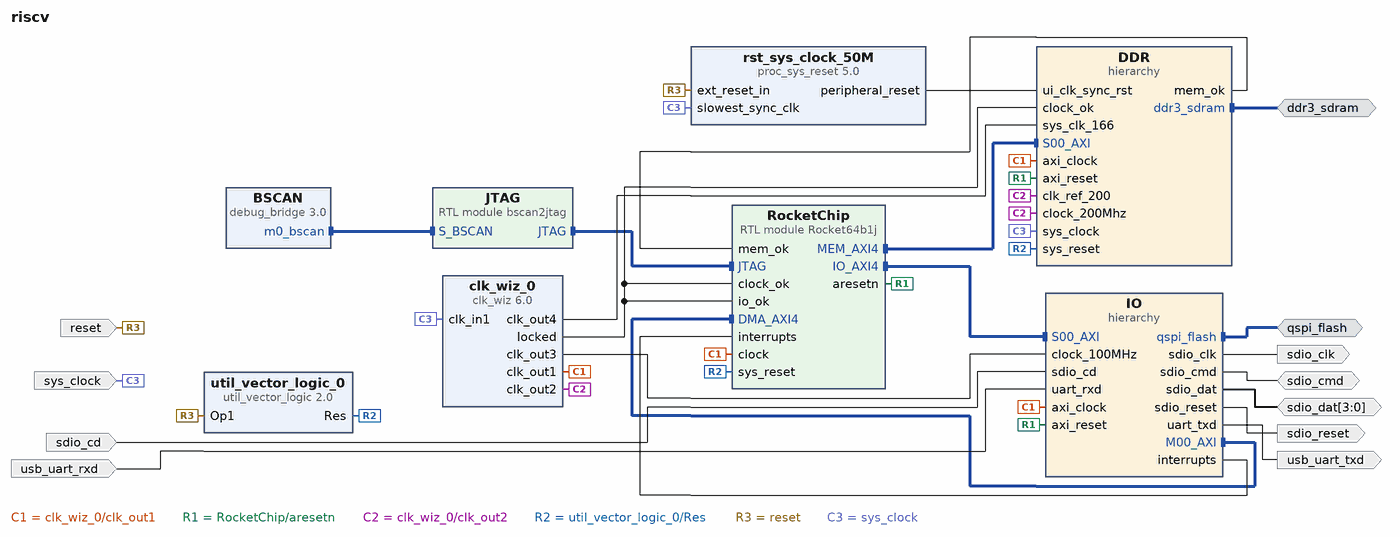
[diagram p0: block diagram of the top level]
# Vivado block design riscv, xc7k325tffg676-1, Vivado 2022.1
create_bd_design riscv

create_bd_intf_port -mode Master -vlnv xilinx.com:interface:ddrx_rtl:1.0 ddr3_sdram
create_bd_intf_port -mode Master -vlnv xilinx.com:interface:spi_rtl:1.0 qspi_flash
create_bd_port -dir I -type rst reset
set_property -dict {CONFIG.POLARITY ACTIVE_LOW} [get_bd_ports reset]
create_bd_port -dir I sdio_cd
create_bd_port -dir O sdio_clk
create_bd_port -dir IO sdio_cmd
create_bd_port -dir IO -from 3 -to 0 sdio_dat
create_bd_port -dir O -type rst sdio_reset
create_bd_port -dir I -type clk sys_clock
set_property -dict {CONFIG.FREQ_HZ 50000000 CONFIG.PHASE 0.0} [get_bd_ports sys_clock]
create_bd_port -dir I usb_uart_rxd
create_bd_port -dir O usb_uart_txd

create_bd_cell -type hier DDR
create_bd_cell -type hier IO
create_bd_cell -type ip -vlnv xilinx.com:ip:debug_bridge:3.0 BSCAN
set_property -dict {CONFIG.C_DEBUG_MODE 7 CONFIG.C_NUM_BS_MASTER 1 CONFIG.C_USER_SCAN_CHAIN 1} [get_bd_cells BSCAN]
create_bd_cell -type module -reference bscan2jtag JTAG
create_bd_cell -type module -reference Rocket64b1j RocketChip
create_bd_cell -type ip -vlnv xilinx.com:ip:clk_wiz:6.0 clk_wiz_0
set_property -dict [list \
  CONFIG.CLKIN1_JITTER_PS 200.0 \
  CONFIG.CLKOUT1_JITTER 170.644 \
  CONFIG.CLKOUT1_PHASE_ERROR 164.985 \
  CONFIG.CLKOUT1_REQUESTED_OUT_FREQ 80.0 \
  CONFIG.CLKOUT1_USED true \
  CONFIG.CLKOUT2_JITTER 142.107 \
  CONFIG.CLKOUT2_PHASE_ERROR 164.985 \
  CONFIG.CLKOUT2_REQUESTED_OUT_FREQ 200 \
  CONFIG.CLKOUT2_USED true \
  CONFIG.CLKOUT3_JITTER 162.035 \
  CONFIG.CLKOUT3_PHASE_ERROR 164.985 \
  CONFIG.CLKOUT3_REQUESTED_OUT_FREQ 100 \
  CONFIG.CLKOUT3_USED true \
  CONFIG.CLKOUT4_JITTER 146.458 \
  CONFIG.CLKOUT4_PHASE_ERROR 164.985 \
  CONFIG.CLKOUT4_REQUESTED_OUT_FREQ 166.66667 \
  CONFIG.CLKOUT4_USED true \
  CONFIG.CLKOUT5_JITTER 125.247 \
  CONFIG.CLKOUT5_PHASE_ERROR 98.575 \
  CONFIG.CLKOUT5_REQUESTED_OUT_FREQ 100.000 \
  CONFIG.CLKOUT5_REQUESTED_PHASE 0.000 \
  CONFIG.CLKOUT5_USED false \
  CONFIG.CLK_IN1_BOARD_INTERFACE sys_clock \
  CONFIG.MMCM_CLKFBOUT_MULT_F 20.000 \
  CONFIG.MMCM_CLKIN1_PERIOD 20.000 \
  CONFIG.MMCM_CLKIN2_PERIOD 10.0 \
  CONFIG.MMCM_CLKOUT0_DIVIDE_F 12.500 \
  CONFIG.MMCM_CLKOUT1_DIVIDE 5 \
  CONFIG.MMCM_CLKOUT2_DIVIDE 10 \
  CONFIG.MMCM_CLKOUT3_DIVIDE 6 \
  CONFIG.MMCM_CLKOUT4_DIVIDE 1 \
  CONFIG.MMCM_CLKOUT4_PHASE 0.000 \
  CONFIG.MMCM_DIVCLK_DIVIDE 1 \
  CONFIG.NUM_OUT_CLKS 4 \
  CONFIG.PRIM_SOURCE Single_ended_clock_capable_pin \
  CONFIG.USE_BOARD_FLOW true \
  CONFIG.USE_PHASE_ALIGNMENT true \
  CONFIG.USE_RESET false \
] [get_bd_cells clk_wiz_0]
create_bd_cell -type ip -vlnv xilinx.com:ip:util_vector_logic:2.0 util_vector_logic_0
set_property -dict {CONFIG.C_OPERATION not CONFIG.C_SIZE 1} [get_bd_cells util_vector_logic_0]
create_bd_cell -type ip -vlnv xilinx.com:ip:proc_sys_reset:5.0 rst_sys_clock_50M

# ---- hierarchy /DDR ----
current_bd_instance /DDR
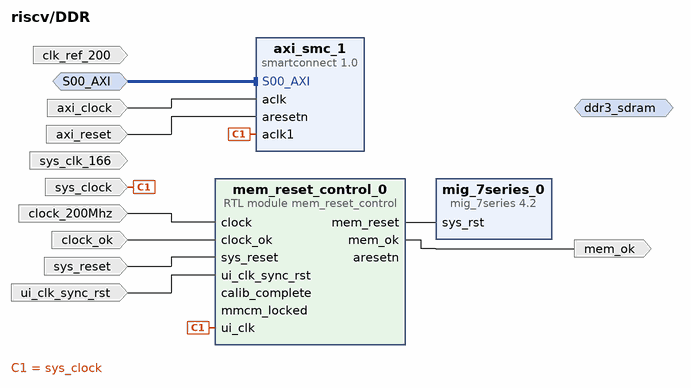
[diagram p1: block diagram inside /DDR]
create_bd_intf_pin -mode Slave -vlnv xilinx.com:interface:aximm_rtl:1.0 S00_AXI
create_bd_intf_pin -mode Master -vlnv xilinx.com:interface:ddrx_rtl:1.0 ddr3_sdram
create_bd_pin -dir I -type clk axi_clock
create_bd_pin -dir I -type rst axi_reset
create_bd_pin -dir I -type clk clk_ref_200
create_bd_pin -dir I -type clk clock_200Mhz
create_bd_pin -dir I -type clk clock_ok
create_bd_pin -dir O mem_ok
create_bd_pin -dir I -type clk sys_clk_166
create_bd_pin -dir I -type rst sys_reset
create_bd_pin -dir I -type clk sys_clock
create_bd_pin -dir I -type rst ui_clk_sync_rst

create_bd_cell -type ip -vlnv xilinx.com:ip:smartconnect:1.0 axi_smc_1
set_property -dict {CONFIG.NUM_CLKS 2 CONFIG.NUM_SI 1} [get_bd_cells axi_smc_1]
create_bd_cell -type module -reference mem_reset_control mem_reset_control_0
create_bd_cell -type ip -vlnv xilinx.com:ip:mig_7series:4.2 mig_7series_0
set_property -dict {CONFIG.BOARD_MIG_PARAM Custom} [get_bd_cells mig_7series_0]

# ---- hierarchy /IO ----
current_bd_instance /IO
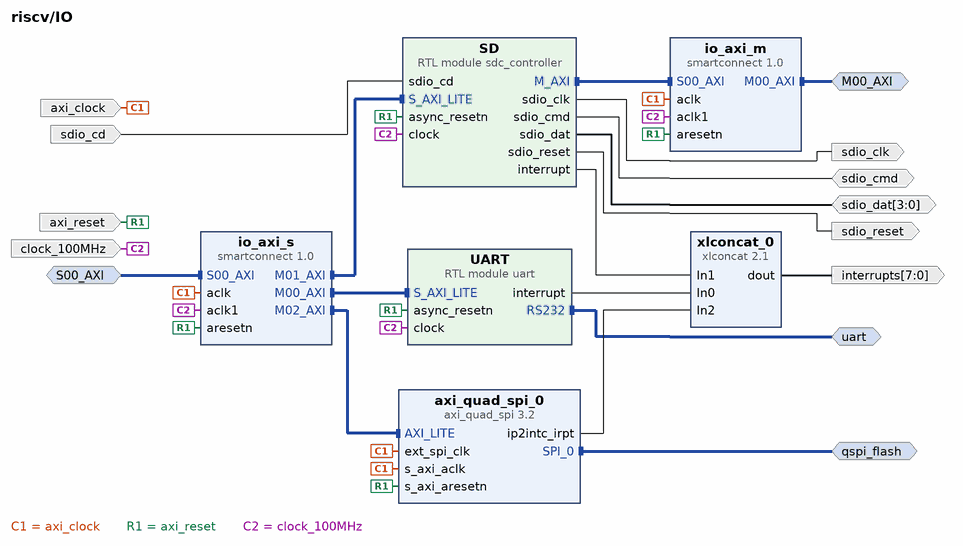
[diagram p2: block diagram inside /IO]
create_bd_intf_pin -mode Master -vlnv xilinx.com:interface:aximm_rtl:1.0 M00_AXI
create_bd_intf_pin -mode Slave -vlnv xilinx.com:interface:aximm_rtl:1.0 S00_AXI
create_bd_intf_pin -mode Master -vlnv xilinx.com:interface:spi_rtl:1.0 qspi_flash
create_bd_intf_pin -mode Master -vlnv xilinx.com:interface:uart_rtl:1.0 uart
create_bd_pin -dir I -type clk axi_clock
create_bd_pin -dir I -type rst axi_reset
create_bd_pin -dir I -type clk clock_100MHz
create_bd_pin -dir O -from 7 -to 0 interrupts
create_bd_pin -dir I sdio_cd
create_bd_pin -dir O sdio_clk
create_bd_pin -dir IO sdio_cmd
create_bd_pin -dir IO -from 3 -to 0 sdio_dat
create_bd_pin -dir O sdio_reset

create_bd_cell -type module -reference sdc_controller SD
set_property -dict {CONFIG.sdio_card_detect_level 0} [get_bd_cells SD]
create_bd_cell -type module -reference uart UART
create_bd_cell -type ip -vlnv xilinx.com:ip:axi_quad_spi:3.2 axi_quad_spi_0
set_property -dict [list \
  CONFIG.C_FAMILY artix7 \
  CONFIG.C_SPI_MEMORY 2 \
  CONFIG.C_SPI_MODE 2 \
  CONFIG.C_SUB_FAMILY artix7 \
  CONFIG.C_S_AXI4_ID_WIDTH 0 \
  CONFIG.C_USE_STARTUP 0 \
  CONFIG.QSPI_BOARD_INTERFACE Custom \
  CONFIG.USE_BOARD_FLOW true \
] [get_bd_cells axi_quad_spi_0]
create_bd_cell -type ip -vlnv xilinx.com:ip:smartconnect:1.0 io_axi_m
set_property -dict {CONFIG.NUM_CLKS 2 CONFIG.NUM_MI 1 CONFIG.NUM_SI 2} [get_bd_cells io_axi_m]
create_bd_cell -type ip -vlnv xilinx.com:ip:smartconnect:1.0 io_axi_s
set_property -dict {CONFIG.NUM_CLKS 2 CONFIG.NUM_MI 3 CONFIG.NUM_SI 1} [get_bd_cells io_axi_s]
create_bd_cell -type ip -vlnv xilinx.com:ip:xlconcat:2.1 xlconcat_0
set_property -dict {CONFIG.NUM_PORTS 8 CONFIG.dout_width 8} [get_bd_cells xlconcat_0]

# ---- connections ----

current_bd_instance /DDR
connect_bd_intf_net -intf_net MEM_AXI4 [get_bd_intf_pins S00_AXI] [get_bd_intf_pins axi_smc_1/S00_AXI]
connect_bd_net [get_bd_pins axi_clock] [get_bd_pins axi_smc_1/aclk]
connect_bd_net [get_bd_pins axi_reset] [get_bd_pins axi_smc_1/aresetn]
# net clk_ref_i_1 has one end: clk_ref_200
connect_bd_net -net clock_0_1 [get_bd_pins clock_200Mhz] [get_bd_pins mem_reset_control_0/clock]
connect_bd_net -net clock_ok_0_1 [get_bd_pins clock_ok] [get_bd_pins mem_reset_control_0/clock_ok]
# net mem_reset_control_0_aresetn has one end: mem_reset_control_0/aresetn
connect_bd_net [get_bd_pins mem_reset_control_0/mem_ok] [get_bd_pins mem_ok]
connect_bd_net [get_bd_pins mem_reset_control_0/mem_reset] [get_bd_pins mig_7series_0/sys_rst]
# net mig_7series_0_init_calib_complete has one end: mem_reset_control_0/calib_complete
# net mig_7series_0_mmcm_locked has one end: mem_reset_control_0/mmcm_locked
connect_bd_net -net mig_7series_0_ui_clk [get_bd_pins sys_clock] [get_bd_pins axi_smc_1/aclk1] [get_bd_pins mem_reset_control_0/ui_clk]
# net sys_clk_i_1 has one end: sys_clk_166
connect_bd_net -net sys_reset_0_1 [get_bd_pins sys_reset] [get_bd_pins mem_reset_control_0/sys_reset]
connect_bd_net [get_bd_pins ui_clk_sync_rst] [get_bd_pins mem_reset_control_0/ui_clk_sync_rst]

current_bd_instance /IO
connect_bd_intf_net [get_bd_intf_pins qspi_flash] [get_bd_intf_pins axi_quad_spi_0/SPI_0]
connect_bd_intf_net [get_bd_intf_pins uart] [get_bd_intf_pins UART/RS232]
connect_bd_intf_net [get_bd_intf_pins M00_AXI] [get_bd_intf_pins io_axi_m/M00_AXI]
connect_bd_intf_net [get_bd_intf_pins S00_AXI] [get_bd_intf_pins io_axi_s/S00_AXI]
connect_bd_intf_net [get_bd_intf_pins UART/S_AXI_LITE] [get_bd_intf_pins io_axi_s/M00_AXI]
connect_bd_intf_net [get_bd_intf_pins SD/S_AXI_LITE] [get_bd_intf_pins io_axi_s/M01_AXI]
connect_bd_intf_net [get_bd_intf_pins axi_quad_spi_0/AXI_LITE] [get_bd_intf_pins io_axi_s/M02_AXI]
connect_bd_intf_net -intf_net sd_axi_m [get_bd_intf_pins SD/M_AXI] [get_bd_intf_pins io_axi_m/S00_AXI]
connect_bd_net [get_bd_pins axi_clock] \
  [get_bd_pins axi_quad_spi_0/ext_spi_clk] [get_bd_pins axi_quad_spi_0/s_axi_aclk] [get_bd_pins io_axi_m/aclk] \
  [get_bd_pins io_axi_s/aclk]
connect_bd_net [get_bd_pins axi_reset] \
  [get_bd_pins SD/async_resetn] [get_bd_pins UART/async_resetn] [get_bd_pins axi_quad_spi_0/s_axi_aresetn] \
  [get_bd_pins io_axi_m/aresetn] [get_bd_pins io_axi_s/aresetn]
connect_bd_net [get_bd_pins SD/interrupt] [get_bd_pins xlconcat_0/In1]
connect_bd_net -net SD_sdio_cd [get_bd_pins sdio_cd] [get_bd_pins SD/sdio_cd]
connect_bd_net [get_bd_pins SD/sdio_clk] [get_bd_pins sdio_clk]
connect_bd_net -net SD_sdio_cmd [get_bd_pins sdio_cmd] [get_bd_pins SD/sdio_cmd]
connect_bd_net -net SD_sdio_dat [get_bd_pins sdio_dat] [get_bd_pins SD/sdio_dat]
connect_bd_net [get_bd_pins SD/sdio_reset] [get_bd_pins sdio_reset]
connect_bd_net [get_bd_pins UART/interrupt] [get_bd_pins xlconcat_0/In0]
connect_bd_net [get_bd_pins axi_quad_spi_0/ip2intc_irpt] [get_bd_pins xlconcat_0/In2]
connect_bd_net [get_bd_pins clock_100MHz] [get_bd_pins SD/clock] [get_bd_pins UART/clock] [get_bd_pins io_axi_m/aclk1] [get_bd_pins io_axi_s/aclk1]
connect_bd_net -net interrupts [get_bd_pins xlconcat_0/dout] [get_bd_pins interrupts]

current_bd_instance /
connect_bd_intf_net [get_bd_intf_pins BSCAN/m0_bscan] [get_bd_intf_pins JTAG/S_BSCAN]
connect_bd_intf_net [get_bd_intf_ports ddr3_sdram] [get_bd_intf_pins DDR/ddr3_sdram]
connect_bd_intf_net [get_bd_intf_ports qspi_flash] [get_bd_intf_pins IO/qspi_flash]
connect_bd_intf_net [get_bd_intf_pins JTAG/JTAG] [get_bd_intf_pins RocketChip/JTAG]
connect_bd_intf_net [get_bd_intf_pins DDR/S00_AXI] [get_bd_intf_pins RocketChip/MEM_AXI4]
connect_bd_intf_net -intf_net io_axi_m [get_bd_intf_pins IO/M00_AXI] [get_bd_intf_pins RocketChip/DMA_AXI4]
connect_bd_intf_net -intf_net io_axi_s [get_bd_intf_pins IO/S00_AXI] [get_bd_intf_pins RocketChip/IO_AXI4]
connect_bd_net -net AXI_clock [get_bd_pins clk_wiz_0/clk_out1] [get_bd_pins DDR/axi_clock] [get_bd_pins IO/axi_clock] [get_bd_pins RocketChip/clock]
connect_bd_net -net AXI_reset [get_bd_pins RocketChip/aresetn] [get_bd_pins DDR/axi_reset] [get_bd_pins IO/axi_reset]
connect_bd_net [get_bd_pins DDR/mem_ok] [get_bd_pins RocketChip/mem_ok]
connect_bd_net [get_bd_pins IO/interrupts] [get_bd_pins RocketChip/interrupts]
connect_bd_net -net IO_sdio_cd [get_bd_ports sdio_cd] [get_bd_pins IO/sdio_cd]
connect_bd_net [get_bd_pins IO/sdio_clk] [get_bd_ports sdio_clk]
connect_bd_net -net IO_sdio_cmd [get_bd_ports sdio_cmd] [get_bd_pins IO/sdio_cmd]
connect_bd_net -net IO_sdio_dat [get_bd_ports sdio_dat] [get_bd_pins IO/sdio_dat]
connect_bd_net [get_bd_pins IO/sdio_reset] [get_bd_ports sdio_reset]
connect_bd_net -net IO_uart_rxd [get_bd_ports usb_uart_rxd] [get_bd_pins IO/uart_rxd]
connect_bd_net [get_bd_pins IO/uart_txd] [get_bd_ports usb_uart_txd]
connect_bd_net -net clk_ref_200_1 [get_bd_pins clk_wiz_0/clk_out2] [get_bd_pins DDR/clk_ref_200] [get_bd_pins DDR/clock_200Mhz]
connect_bd_net [get_bd_pins clk_wiz_0/clk_out3] [get_bd_pins IO/clock_100MHz]
connect_bd_net -net clock_ok [get_bd_pins clk_wiz_0/locked] \
  [get_bd_pins DDR/clock_ok] [get_bd_pins RocketChip/clock_ok] [get_bd_pins RocketChip/io_ok]
connect_bd_net -net reset_h [get_bd_pins util_vector_logic_0/Res] [get_bd_pins DDR/sys_reset] [get_bd_pins RocketChip/sys_reset]
connect_bd_net -net reset_l [get_bd_ports reset] [get_bd_pins util_vector_logic_0/Op1] [get_bd_pins rst_sys_clock_50M/ext_reset_in]
connect_bd_net [get_bd_pins rst_sys_clock_50M/peripheral_reset] [get_bd_pins DDR/ui_clk_sync_rst]
connect_bd_net -net sys_clk_166_1 [get_bd_pins clk_wiz_0/clk_out4] [get_bd_pins DDR/sys_clk_166]
connect_bd_net [get_bd_ports sys_clock] [get_bd_pins clk_wiz_0/clk_in1] [get_bd_pins DDR/sys_clock] [get_bd_pins rst_sys_clock_50M/slowest_sync_clk]

# ---- address map ----
assign_bd_address -offset 0x00000000 -range 4G -target_address_space [get_bd_addr_spaces IO/SD/M_AXI] [get_bd_addr_segs RocketChip/DMA_AXI4/reg0]
assign_bd_address -offset 0x44A00000 -range 64K -target_address_space [get_bd_addr_spaces RocketChip/IO_AXI4] [get_bd_addr_segs IO/axi_quad_spi_0/AXI_LITE/Reg]
assign_bd_address -offset 0x60000000 -range 64K -target_address_space [get_bd_addr_spaces RocketChip/IO_AXI4] [get_bd_addr_segs IO/SD/S_AXI_LITE/reg0]
assign_bd_address -offset 0x60010000 -range 64K -target_address_space [get_bd_addr_spaces RocketChip/IO_AXI4] [get_bd_addr_segs IO/UART/S_AXI_LITE/reg0]

validate_bd_design
save_bd_design
